# Altium schematic sheet Sheet1.SchDoc
size A
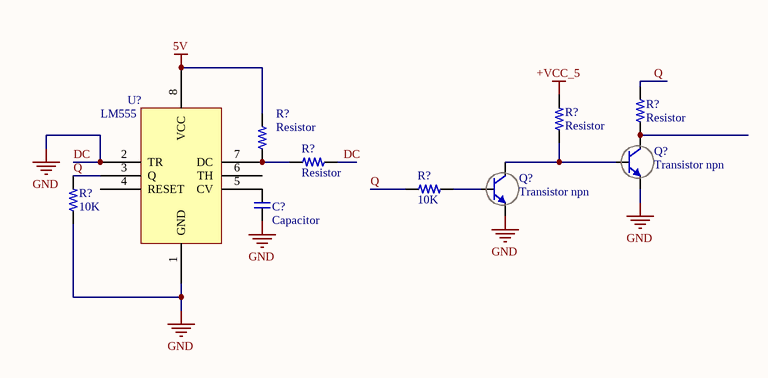
[diagram p0: Sheet1.SchDoc]

## Parts
(Parts that share a designator on the sheet are numbered #1, #2 ... from top to bottom, then left to right.)
C?  Capacitor
Q?#1  Transistor npn
Q?#2  Transistor npn
R?#1  Resistor  [RESISTOR_1608]
R?#2  Resistor  [RESISTOR_1608]
R?#3  Resistor  [RESISTOR_1608]
R?#4  Resistor  [RESISTOR_1608]
R?#5  10K  [RESISTOR_1608]
R?#6  10K  [RESISTOR_1608]
U?  LM555

## Nets
5V: R?#3.2 U?.8(VCC)
+VCC_5: R?#2.2
DC: C?.1 Q?#1.1(E) Q?#2.1(E) R?#4.2 R?#6.1 U?.1(GND) U?.2(TR)  [also labelled GND]
Q: R?#1.2 R?#5.1 R?#6.2 U?.3(Q)
NetC?_2: C?.2 U?.5(CV)
NetQ?#1_2: Q?#1.2(B) Q?#2.3(C) R?#2.1
NetQ?#1_3: Q?#1.3(C) R?#1.1
NetQ?#2_2: Q?#2.2(B) R?#5.2
NetR?#3_1: R?#3.1 R?#4.1 U?.7(DC)

Not connected (* = marked no-connect by the designer): U? 4(RESET) 6(TH)

## Library data of the parts
Q?#1 Q?#2 = npn
R?#5 R?#6 = Resistor
U? = LM555: Timer
C? = Capacitor: .SCH_CHECKED: *; .PCB_CHECKED: *